# EAGLE design Adafruit Circuit Playground Bluefruit (EAGLE 9.3.2)
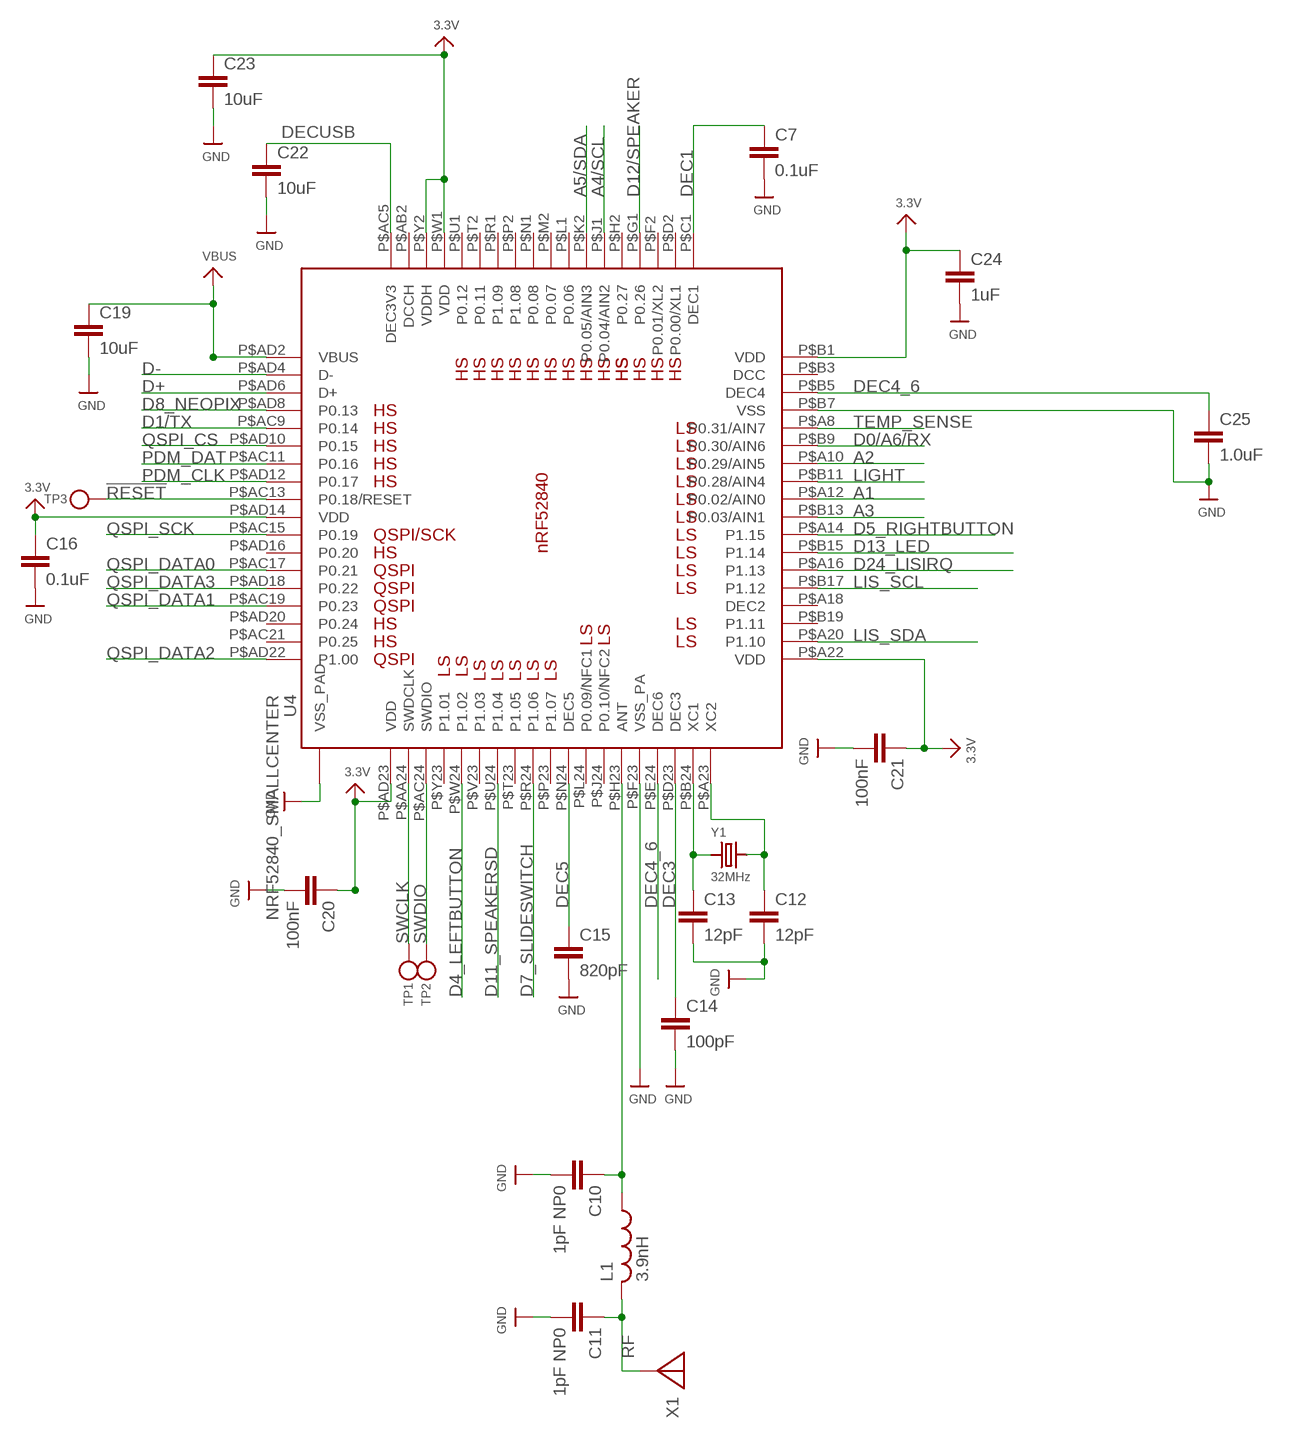
[diagram p0: schematic, sheet 1, part 1 of 2]
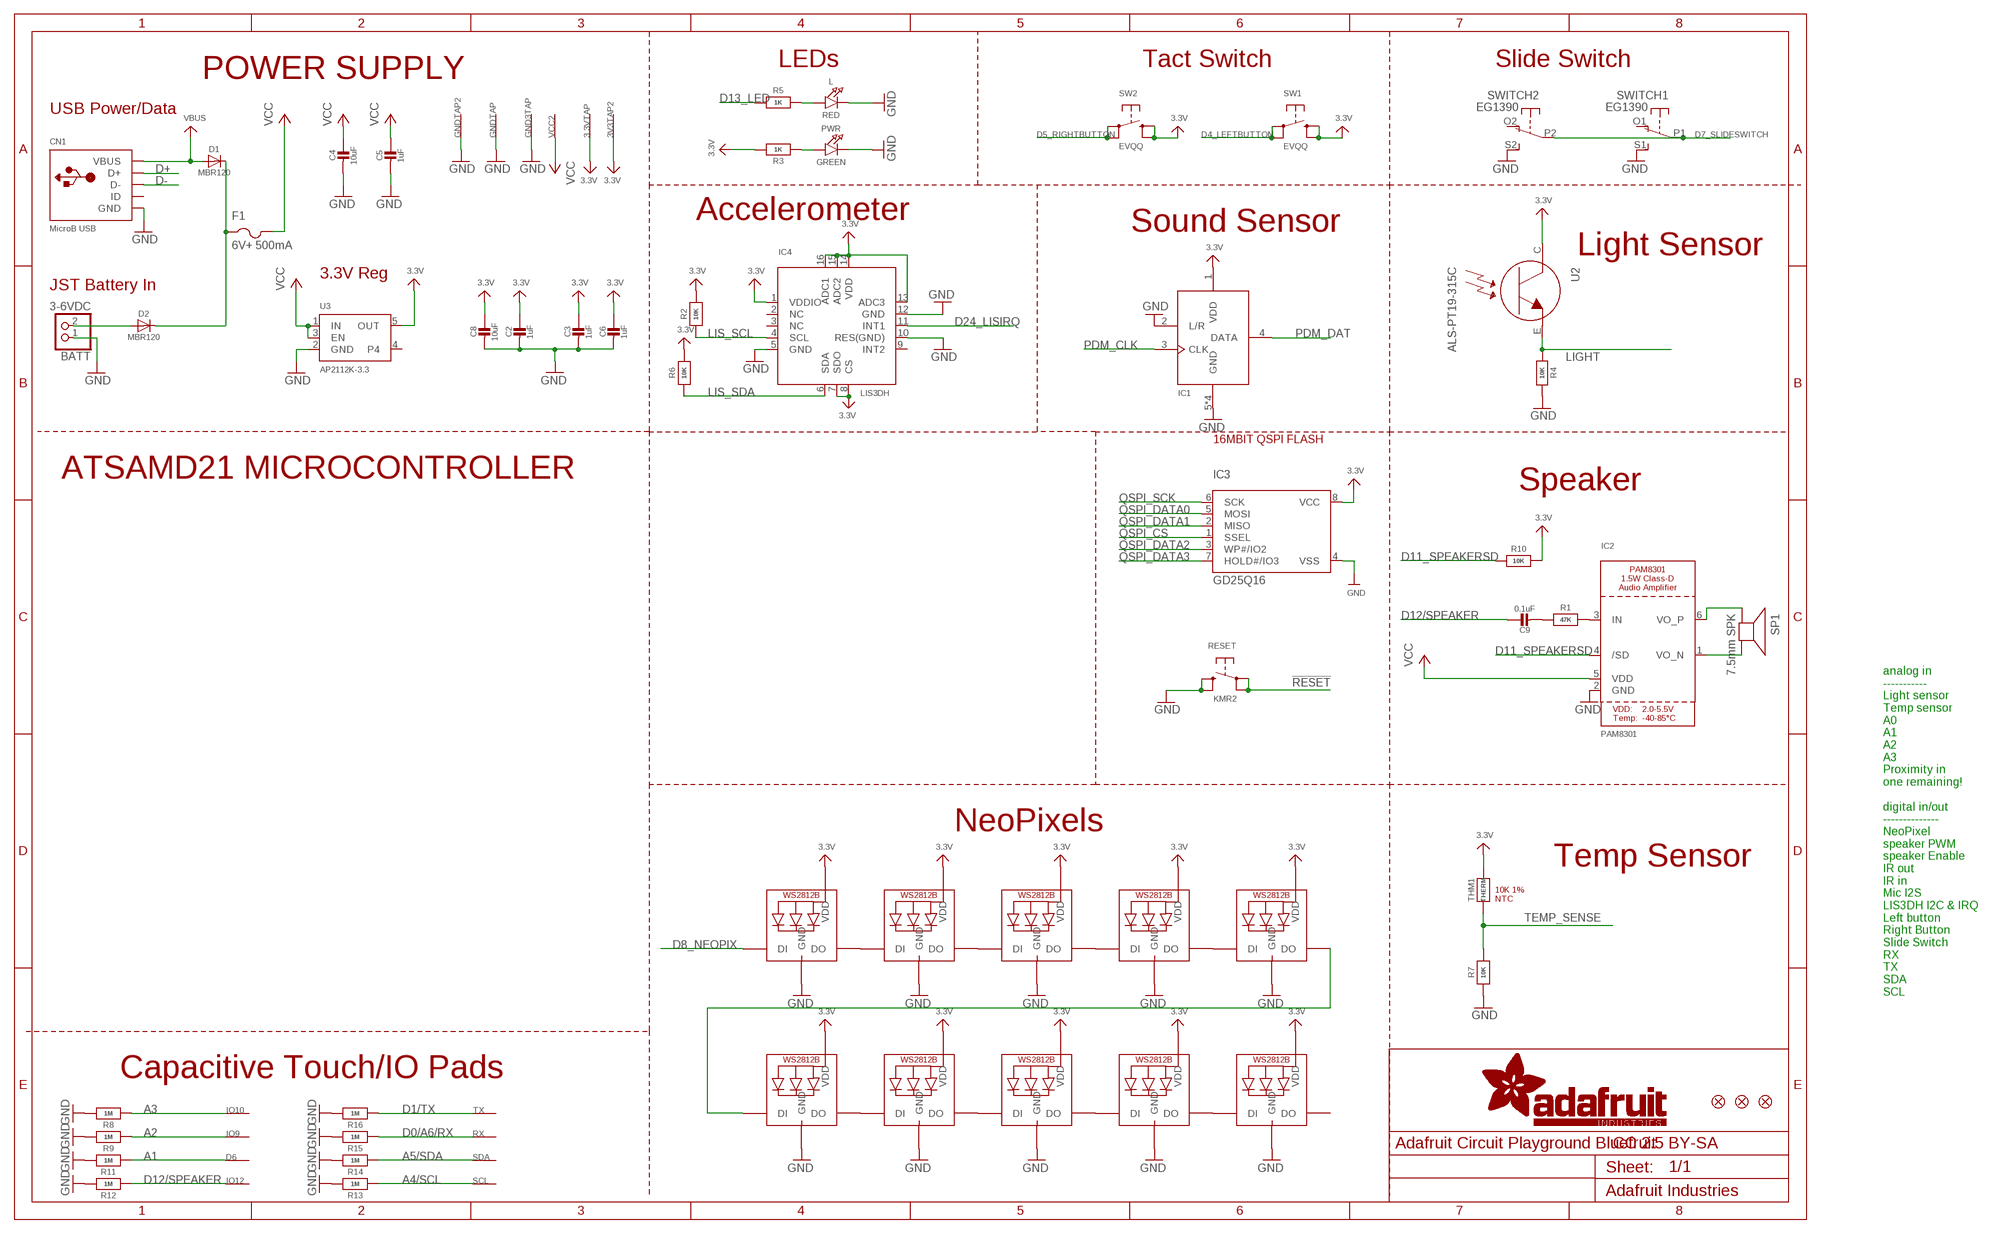
[diagram p1: schematic, sheet 1, part 2 of 2]

## Parts
3.3VTAP  SEWTAP-ALLIGATOR  [SEWALLI]
3V3TAP2  SEWTAP-ALLIGATOR  [SEWALLI]
BATT  3-6VDC  CON_JST_PH_2PIN  [JSTPH2]
C2  1uF  CAP_CERAMIC0603_NO  [0603-NO]
C3  1uF  CAP_CERAMIC0603_NO  [0603-NO]
C4  10uF  CAP_CERAMIC0805-NOOUTLINE  [0805-NO]
C5  1uF  CAP_CERAMIC0603_NO  [0603-NO]
C6  1uF  CAP_CERAMIC0603_NO  [0603-NO]
C7  0.1uF  CAPACITOR_0603_N  [RESC0603_N]
C8  10uF  CAP_CERAMIC0805-NOOUTLINE  [0805-NO]
C9  0.1uF  CAP_CERAMIC0603_NO  [0603-NO]
C10  1pF NP0  CAPACITOR_0402_N  [RESC0402_N]
C11  1pF NP0  CAPACITOR_0402_N  [RESC0402_N]
C12  12pF  CAPACITOR_0402_N  [RESC0402_N]
C13  12pF  CAPACITOR_0402_N  [RESC0402_N]
C14  100pF  CAPACITOR_0402_N  [RESC0402_N]
C15  820pF  CAPACITOR_0402_N  [RESC0402_N]
C16  0.1uF  CAPACITOR_0402_N  [RESC0402_N]
C19  10uF  CAPACITOR_0805_N  [RESC0805_N]
C20  100nF  CAPACITOR_0402_N  [RESC0402_N]
C21  100nF  CAPACITOR_0402_N  [RESC0402_N]
C22  10uF  CAPACITOR_0805_N  [RESC0805_N]
C23  10uF  CAPACITOR_0805_N  [RESC0805_N]
C24  1uF  CAPACITOR_0603_N  [RESC0603_N]
C25  1.0uF  CAPACITOR_0603_N  [RESC0603_N]
CN1  MicroB USB  USB_MICRO_20329_V2  [4UCONN_20329_V2]
D1  MBR120  DIODESOD-123  [SOD-123]
D2  MBR120  DIODESOD-123  [SOD-123]
D6  SEWTAP-ALLIGATOR  [SEWALLI]
F1  6V+ 500mA  PTCFUSE-1206  [R1206]
GND3TAP  SEWTAP-ALLIGATOR  [SEWALLI]
GNDTAP  SEWTAP-ALLIGATOR  [SEWALLI]
GNDTAP2  SEWTAP-ALLIGATOR  [SEWALLI]
IC1  MIC_PDM  MIC_PDM_SPK0415  [SPK0415HM4H]
IC2  PAM8301  [SOT23-6]
IC3  GD25Q16  SPIFLASH_8PINUX  [USON8]
IC4  LIS3DH  ACCEL_LIS3DHTR  [LGA16_3X3MM]
IO9  SEWTAP-ALLIGATOR  [SEWALLI]
IO10  SEWTAP-ALLIGATOR  [SEWALLI]
IO12  SEWTAP-ALLIGATOR  [SEWALLI]
L  RED  LED0805_NOOUTLINE  [CHIPLED_0805_NOOUTLINE]
L1  3.9nH  INDUCTOR_0402_N  [RESC0402_N]
LED1  WS2812B3535  [LED3535]
LED2  WS2812B3535  [LED3535]
LED3  WS2812B3535  [LED3535]
LED4  WS2812B3535  [LED3535]
LED5  WS2812B3535  [LED3535]
LED6  WS2812B3535  [LED3535]
LED7  WS2812B3535  [LED3535]
LED8  WS2812B3535  [LED3535]
LED9  WS2812B3535  [LED3535]
LED10  WS2812B3535  [LED3535]
PWR  GREEN  LED0805_NOOUTLINE  [CHIPLED_0805_NOOUTLINE]
R1  47K  RESISTOR_0603_NOOUT  [0603-NO]
R2  10K  RESISTOR_0603_NOOUT  [0603-NO]
R3  1K  RESISTOR_0603_NOOUT  [0603-NO]
R4  10K  RESISTOR_0603_NOOUT  [0603-NO]
R5  1K  RESISTOR_0603_NOOUT  [0603-NO]
R6  10K  RESISTOR_0603_NOOUT  [0603-NO]
R7  10K  RESISTOR_0603_NOOUT  [0603-NO]
R8  1M  RESISTOR_0603_NOOUT  [0603-NO]
R9  1M  RESISTOR_0603_NOOUT  [0603-NO]
R10  10K  RESISTOR_0603_NOOUT  [0603-NO]
R11  1M  RESISTOR_0603_NOOUT  [0603-NO]
R12  1M  RESISTOR_0603_NOOUT  [0603-NO]
R13  1M  RESISTOR_0603_NOOUT  [0603-NO]
R14  1M  RESISTOR_0603_NOOUT  [0603-NO]
R15  1M  RESISTOR_0603_NOOUT  [0603-NO]
R16  1M  RESISTOR_0603_NOOUT  [0603-NO]
RESET  KMR2  SWITCH_TACT_SMT4.6X2.8  [BTN_KMR2_4.6X2.8]
RX  SEWTAP-ALLIGATOR  [SEWALLI]
SCL  SEWTAP-ALLIGATOR  [SEWALLI]
SDA  SEWTAP-ALLIGATOR  [SEWALLI]
SP1  7.5mm SPK  SPEAKER_7.5MM  [BUZZER_SMT_7.5MM]
SW1  EVQQ  SWITCH_TACT_SMT_EVQQ2_SMALL  [EVQ-Q2_SMALLER]
SW2  EVQQ  SWITCH_TACT_SMT_EVQQ2_SMALL  [EVQ-Q2_SMALLER]
SWITCH  EG1390  DPDT-EG1390  [EG1390]
THM1  THERM  RESISTOR_0402  [_0402]
TP1  TESTPOINTROUND1.5MMNO  [TESTPOINT_ROUND_1.5MM_NO]
TP2  TESTPOINTROUND1.5MMNO  [TESTPOINT_ROUND_1.5MM_NO]
TP3  TESTPOINTROUND1.5MMNO  [TESTPOINT_ROUND_1.5MM_NO]
TX  SEWTAP-ALLIGATOR  [SEWALLI]
U2  ALS-PT19-315C  PHOTOTRANSISTOR_PT19-315C  [ALS-PT19-315C]
U3  AP2112K-3.3  VREG_SOT23-5  [SOT23-5]
U4  NRF52840_SMALLCENTER  [AQFN50P700X800X85_HS-74N_SMALLCENTER]
U$2  FIDUCIAL_1MM  [FIDUCIAL_1MM]
U$3  FIDUCIAL_1MM  [FIDUCIAL_1MM]
U$6  FIDUCIAL_1MM  [FIDUCIAL_1MM]
VCC2  SEWTAP-ALLIGATOR  [SEWALLI]
X1  ANTENNA_JOHANSON_2450AT18B100  [ANT_2450AT18B100]
Y1  32MHz  CRYSTAL2.5X2.0  [CRYSTAL_2.5X2]

## Nets
3.3V [power]: 3.3VTAP.P$1(SEW) 3V3TAP2.P$1(SEW) C2.1 C3.1 C6.1 C8.1 C16.1 C20.1 C21.1 C23.1 C24.1 IC1.1(VDD) IC3.8(VCC) IC4.1(VDDIO) IC4.7(SDO) IC4.8(CS) IC4.13(ADC3) IC4.14(VDD) IC4.15(ADC2) IC4.16(ADC1) LED1.2(VDD) LED2.2(VDD) LED3.2(VDD) LED4.2(VDD) LED5.2(VDD) LED6.2(VDD) LED7.2(VDD) LED8.2(VDD) LED9.2(VDD) LED10.2(VDD) R2.2 R3.2 R6.2 R10.2 SW1.B'(S1) SW1.B(S) SW2.B'(S1) SW2.B(S) THM1.2 U2.C U3.5(OUT) U4.P$A22(VDD) U4.P$AD14(VDD) U4.P$AD23(VDD) U4.P$B1(VDD) U4.P$W1(VDD) U4.P$Y2(VDDH)
!RESET: RESET.A'(P1) RESET.A(P) TP3.P$1 U4.P$AC13(P0.18/RESET)
A1: D6.P$1(SEW) R11.1 U4.P$A12(P0.02/AIN0)
A2: IO9.P$1(SEW) R9.1 U4.P$A10(P0.29/AIN5)
A3: IO10.P$1(SEW) R8.1 U4.P$B13(P0.03/AIN1)
A4/SCL: R13.1 SCL.P$1(SEW) U4.P$J1(P0.04/AIN2)
A5/SDA: R14.1 SDA.P$1(SEW) U4.P$K2(P0.05/AIN3)
D0/A6/RX: R15.1 RX.P$1(SEW) U4.P$B9(P0.30/AIN6)
D1/TX: R16.1 TX.P$1(SEW) U4.P$AC9(P0.14)
D4_LEFTBUTTON: SW1.A'(P1) SW1.A(P) U4.P$W24(P1.02)
D5_RIGHTBUTTON: SW2.A'(P1) SW2.A(P) U4.P$A14(P1.15)
D7_SLIDESWITCH: SWITCH.P1(1:P) SWITCH.P2(2:P) U4.P$R24(P1.06)
D8_NEOPIX: LED6.1(DI) U4.P$AD8(P0.13)
D11_SPEAKERSD: IC2.4(/SD) R10.1 U4.P$U24(P1.04)
D12/SPEAKER: C9.1 IO12.P$1(SEW) R12.1 U4.P$G1(P0.26)
D13_LED: R5.1 U4.P$B15(P1.14)
D24_LISIRQ: IC4.11(INT1) U4.P$A16(P1.13)
D+: CN1.D+ U4.P$AD6(D+)
D-: CN1.D- U4.P$AD4(D-)
DEC1: C7.1 U4.P$C1(DEC1)
DEC3: C14.1 U4.P$D23(DEC3)
DEC4_6: C25.1 U4.P$B5(DEC4) U4.P$E24(DEC6)
DEC5: C15.1 U4.P$N24(DEC5)
DECUSB: C22.1 U4.P$AC5(DEC3V3)
GND [power]: BATT.1 C2.2 C3.2 C4.2 C5.2 C6.2 C7.2 C8.2 C10.2 C11.2 C12.2 C13.2 C14.2 C15.2 C16.2 C19.2 C20.2 C21.2 C22.2 C23.2 C24.2 C25.2 CN1.BASE@1(GND) CN1.BASE@2(GND) CN1.GND CN1.SPRT@1(GND) CN1.SPRT@2(GND) CN1.SPRT@3(GND) CN1.SPRT@4(GND) GND3TAP.P$1(SEW) GNDTAP2.P$1(SEW) GNDTAP.P$1(SEW) IC1.2(L/R) IC1.5(GND) IC1.6(GND) IC1.7(GND) IC1.8(GND) IC2.2(GND) IC3.4(VSS) IC4.5(GND) IC4.10(RES(GND)) IC4.12(GND) L.C LED1.4(GND) LED2.4(GND) LED3.4(GND) LED4.4(GND) LED5.4(GND) LED6.4(GND) LED7.4(GND) LED8.4(GND) LED9.4(GND) LED10.4(GND) PWR.C R4.1 R7.1 R8.2 R9.2 R11.2 R12.2 R13.2 R14.2 R15.2 R16.2 RESET.B'(S1) RESET.B(S) SWITCH.S1(1:S) SWITCH.S2(2:S) U3.2(GND) U4.P$B7(VSS) U4.P$F23(VSS_PA) U4.THERMPAD(VSS_PAD)
LIGHT: R4.2 U2.E U4.P$B11(P0.28/AIN4)
LIS_SCL: IC4.4(SCL) R2.1 U4.P$B17(P1.12)
LIS_SDA: IC4.6(SDA) R6.1 U4.P$A20(P1.10)
N$1: PWR.A R3.1
N$3: D1.C D2.C F1.1
N$4: C10.1 L1.1 U4.P$H23(ANT)
N$6: C9.2 R1.1
N$7: BATT.2 D2.A
N$8: IC2.3(IN) R1.2
N$9: IC2.6(VO_P) SP1.+
N$10: L.A R5.2
N$11: LED1.1(DI) LED2.3(DO)
N$12: LED1.3(DO) LED3.1(DI)
N$13: LED2.1(DI) LED10.3(DO)
N$14: LED6.3(DO) LED7.1(DI)
N$15: IC2.1(VO_N) SP1.-
N$16: LED7.3(DO) LED8.1(DI)
N$17: LED8.3(DO) LED9.1(DI)
N$18: LED9.3(DO) LED10.1(DI)
N$19: LED3.3(DO) LED4.1(DI)
N$20: LED4.3(DO) LED5.1(DI)
N$22: C12.1 U4.P$A23(XC2) Y1.3
N$23: C13.1 U4.P$B24(XC1) Y1.1
PDM_CLK: IC1.3(CLK) U4.P$AD12(P0.17)
PDM_DAT: IC1.4(DATA) U4.P$AC11(P0.16)
QSPI_CS: IC3.1(SSEL) U4.P$AD10(P0.15)
QSPI_DATA0: IC3.5(MOSI) U4.P$AC17(P0.21)
QSPI_DATA1: IC3.2(MISO) U4.P$AC19(P0.23)
QSPI_DATA2: IC3.3(WP#/IO2) U4.P$AD22(P1.00)
QSPI_DATA3: IC3.7(HOLD#/IO3) U4.P$AD18(P0.22)
QSPI_SCK: IC3.6(SCK) U4.P$AC15(P0.19)
RF: C11.1 L1.2 X1.FP
SWCLK: TP1.P$1 U4.P$AA24(SWDCLK)
SWDIO: TP2.P$1 U4.P$AC24(SWDIO)
TEMP_SENSE: R7.2 THM1.1 U4.P$A8(P0.31/AIN7)
VBUS [power]: C19.1 CN1.VBUS D1.A U4.P$AD2(VBUS)
VCC: C4.1 C5.1 F1.2 IC2.5(VDD) U3.1(IN) U3.3(EN) VCC2.P$1(SEW)
Unconnected: CN1.ID IC4.2(NC) IC4.3(NC) IC4.9(INT2) LED5.3(DO) SWITCH.O1(1:O) SWITCH.O2(2:O) U3.4 U4.P$A18(DEC2) U4.P$AB2(DCCH) U4.P$AC21(P0.25) U4.P$AD16(P0.20) U4.P$AD20(P0.24) U4.P$B3(DCC) U4.P$B19(P1.11) U4.P$D2(P0.00/XL1) U4.P$F2(P0.01/XL2) U4.P$H2(P0.27) U4.P$J24(P0.10/NFC2) U4.P$L1(P0.06) U4.P$L24(P0.09/NFC1) U4.P$M2(P0.07) U4.P$N1(P0.08) U4.P$P2(P1.08) U4.P$P23(P1.07) U4.P$R1(P1.09) U4.P$T2(P0.11) U4.P$T23(P1.05) U4.P$U1(P0.12) U4.P$V23(P1.03) U4.P$Y23(P1.01)

## Notes on the sheet
- LEDs | Tact Switch | Slide Switch
- POWER SUPPLY
- USB Power/Data
- Accelerometer
- Sound Sensor
- Light Sensor
- 3.3V Reg
- JST Battery In
- 16MBIT QSPI FLASH
- ATSAMD21 MICROCONTROLLER
- Speaker
- NeoPixels
- Temp Sensor
- 10K 1%
  NTC
- analog in
  -----------
  Light sensor ✓
  Temp sensor ✓
  A0 ✓
  A1 ✓
  A2 ✓
  A3 ✓
  Proximity in ✓
  one remaining!
  
  digital in/out
  --------------
  NeoPixel ✓
  speaker PWM ✓
  speaker Enable ✓
  IR out ✓
  IR in ✓
  Mic I2S ✓
  LIS3DH I2C & IRQ
  Left button ✓
  Right Button ✓
  Slide Switch ✓
  RX ✓
  TX ✓
  SDA ✓
  SCL ✓
- Capacitive Touch/IO Pads
- CC 2.5 BY-SA

## Library data of the parts
3.3VTAP 3V3TAP2 D6 GND3TAP GNDTAP GNDTAP2 IO9 IO10 IO12 RX SCL SDA TX VCC2 = microbuilder:SEWTAP
BATT = microbuilder:CON_JST_PH_2PIN: JST 2-Pin Right-Angle Connector PH-Series - 4UConnector: 17311 SH-Series - 4UConnector: 07278
C2-C6 C8 C9 = microbuilder:CAP_CERAMIC: Ceramic Capacitors For new designs, use the packages preceded by an '_' character since they are more reliable: The following footprints should be used on most boards: _0402 - Standard footprint for regular board layouts _0603 - Standard footprint for regular board layouts _0805 - Standard footprint for regular board layouts _1206 - Standard footprint for regular board layouts For extremely tight-pitch boards where space is at a premium, the following 'micro-pitch' footprints can be used (smaller pads, no silkscreen outline, etc.): _0402MP - Micro-pitch footprint for very dense/compact boards _0603MP - Micro-pitch footprint for very dense/compact boards _0805MP - Micro-pitch footprint for very dense/compact boards _1206MP - Micro-pitch footprint for very dense/compact boards
C7 C10-C16 C19-C25 = Nordic_misc:CAPACITOR: Generic chip capacitor
CN1 = microbuilder:USB: USB Connectors USBMINIB - Surface Mount Female Mini-B USB Connector 4UConnector: 06564
D1 D2 = microbuilder:DIODE: Diode SMA Model Volts Amps Type Vf Ir Digikey # Notes SSA34-E3 40V 3A Schottky 480mV @ 3A 200uA @ 40V SSA34-E3/61TGITR-ND CDBA120-G 20V 1A Schottky 500mV @ 1A 500uA @ 20V 641-1014-6-ND REEL MBRA210 10V 2A Schottky 350mV @ 2A 700uA @ 10V MBRA210LT3 SOD-123 Model Volts Amps Type Vf Ir Order # Notes BAT54T1G 30V 200mA Schottky 800mV @ 200mA 2uA @ 25V BAT54T1GOSTR-ND B0530W 30V 500mA Schottky 430mV @ 500mA 130uA @ 30V B0530W-FDICT-ND REEL MBR120 20V 1A Schottky 340mV @ 1A MBR120VLSFT1GOSCT-ND SOD-323 Model Volts Amps Type Vf Ir Order # Notes PMEG2005EJ 20V 500mA Schottky 355mV @ 500mA 568-4110-1-ND ZLLS410 10V 570mA Schottky 380mV @ 570mA ZLLS410CT-ND 1N4148WS 75V 150mA Silicon/Simple 1V 1N4148WSFSCT-ND REEL SOD-523 Model Volts Amps Type Vf Ir Order # Notes BAT54XV2 30V 200mA Schottky 0.8V @ 100mA BAT54XV2CT-ND TB751S 30V 30mA Schottky RB751S-40TE61CT-ND SOT23-R/W (R = Solder Paste/Reflow Ovens, W = Hand-Soldering) Model Volts Amps Type Vf Ir Order # Notes BAT54FILM 40V 300mA Schottky 497-7162-1-ND POWERDI-5 Model Volts Amps Type Vf Ir Order # Notes PDS560 60V 5A Schottky 670mV @ 5A 150uA @ 60V PDS560DICT-ND
F1 = adafruit:PTCFUSE: PTC fuses, resettable thermistors
IC1 = microbuilder:MIC_PDM
IC2 = microbuilder:PAM8301
IC3 = microbuilder:SPIFLASH_8PIN: SOIC8 SPI Flash Be careful with the size since SOIC8 flash comes in several 'widths' SOIC8 150 mil M25P16 - 16Mbit (2Mbit x 8) Serial Flash (75MHz SPI Bus), Supply: 2.7-3.6V Digikey: SOIC8 - M25P16-VMN6P-ND SOIC8 208 mil W25Q16BVSSIG - 16Mbit (2Mbit x 8) Serial Flash (104MHz SPI Bus), Supply: 2.7-3.6V Digikey: SOIC8 - W25Q16BVSSIG-ND
IC4 = microbuilder:ACCEL_LIS3DHTR: LIS3DHTR 3-Axis Accelerometer with I2C/SPI Interface VDD: 1.71-3.6V VDDIO: 1.71-VDD+0.1V Scale: +/-2g, 4g, 8g, 16g with 16--bit data output Temp:: -40°C - 85°C Mouser: 511-LIS3DHTR Digikey: 497-10613-1-ND
L PWR = microbuilder:LED: LED 0603 - 0603 Surface Mount Package 2mA: Green LED - Low Power (3.9mcd, 2ma, 1.7Vf) - Digikey: 475-2709-2-ND Orange LED - Low Power (9.8mcd, 2ma, 1.8Vf) - Digikey: 475-1194-2-ND Red LED - Low Power (5mcd, 2ma, 1.8Vf) - Digikey: 475-1195-2-ND Yellow LED - Low Power (7mcd, 2ma, 1.8Vf) - Digikey: 475-1196-2-ND 5mA: Blue LED - Low Power (17mcd, 5ma, 2.9Vf) - Digikey: LNJ937W8CRACT-ND 0805 - 0805 Surface Mount Package 2mA: Red LED (8.8mcd, 2mA, 1.8Vf, Clear) - Low Power [Digikey: 475-2510-1-ND] Green LED (5mcd, 2mA, 1.8Vf, Clear) - Low Power [Digikey: 475-2730-1-ND] Yellow LED (11.3mcd, 2mA, 1.8Vf, Clear) - Low Power [Digikey: 475-2555-1-ND] 20mA: Red LED (104mcd, 20mA, Diffused) - LS R976 [Digikey: 475-1278-6-ND] Red LED (12mcd, 20mA, 2.0Vf, Clear) - APT2012EC [Digikey: 754-1128-1-ND] Green LED (15mcd, 20mA, 2.2Vf, Clear) - APT2012GC [Digikey: 754-1131-1-ND] Orange LED (160mcd, 20mA, 2.1Vf, Clear) - APT2012SECK [Digikey: 754-1130-1-ND] 1206 - 1206 Surface Mount Package Green LED (26mcd, 20mA, Diffused) - LG N971 [Digikey: 475-1407-6-ND] Red LED (15mcd, 20mA, Diffused) - LH N974 [Digikey: 475-1416-6-ND] Cree - Cree High-Power Surface Mount LEDs XPEBWT-L1-0000-00D50 - White 111lm 350mA 2.9Vf 6200K 110° XTEAWT-00-0000-00000LEE3 - White 114lm 350mA 2.85Vf 5000K 115° Everlight - Everlight 45-21 Series Surface Mount LEDs 45-21/QK2C-B2832AC2CB2/2T - Warm White 2000mcd 20mA 3.25Vf 3050K 120° 45-21/LK2C-B38452C4CB2/2T - Nuetral White 2000mcd 20mA 3.25Vf 4150K 120° 45-21/LK2C-B50634C6CB2/2T - Cold White 2200mcd 20mA 3.25Vf 5650K 120° PLCC2 Reverse Mount LS T77K-J1L2-1-0-2-R18-Z - Red 11.25mcd 2mA 1.8Vf 630nm 120° LO T77K-L1M2-24-Z - Orange 19.6mcd 2mA 1.8Vf 606nm 120° LY T77K-K2M1-26-Z - Yellow 15.7mcd 2mA 1.8Vf 587nm 120°
L1 = Nordic_misc:INDUCTOR: Generic chip inductor
LED1-LED10 = microbuilder:WS2812B
R1-R16 THM1 = microbuilder:RESISTOR: Resistors For new designs, use the packages preceded by an '_' character since they are more reliable: The following footprints should be used on most boards: _0402 - Standard footprint for regular board layouts _0603 - Standard footprint for regular board layouts _0805 - Standard footprint for regular board layouts _1206 - Standard footprint for regular board layouts For extremely tight-pitch boards where space is at a premium, the following 'micro-pitch' footprints can be used (smaller pads, no silkscreen outline, etc.): _0402MP - Micro-pitch footprint for very dense/compact boards _0603MP - Micro-pitch footprint for very dense/compact boards _0805MP - Micro-pitch footprint for very dense/compact boards _1206MP - Micro-pitch footprint for very dense/compact boards
RESET SW1 SW2 = microbuilder:SWITCH_TACT_SMT: SMT Tact Switches 6x6mm - Digikey: P12940SCT-ND KMR2 (4.6x2.8mm) - Digikey: 401-1426-1-ND EVQ-PQHB55 - Light Touch, 160GF (4.5x4.5mm) - Digikey: P8090SCT-ND KMT0 - KMT021 NGJ LHS (etc.) IP68/Waterproof - Digikey: CKN10289CT-ND
SP1 = microbuilder:SPEAKER: SPEAKER Source: Buerklin Added PS12 (for part # PS1240 piezo) http://www.ladyada.net/library/pcb/eaglelibrary.html
SWITCH = adafruit:DPDT
TP1-TP3 = microbuilder:TESTPOINT: Test Point Various test points for characterisation and PCB testing TESTPOINT_SMT - Compact Surface Mount Test Point [Digikey: 5016KTR-ND]
U2 = microbuilder:PHOTOTRANSISTOR: ALS-PT19-315C - Analog Light Sensor VCC: 2.5-5.5V
U3 = microbuilder:VREG_SOT23-5: SOT23-5 Fixed Voltage Regulators Part Current Out V Out V In V Dropout θJA (°C/W) TJ (°C) Digikey Part No. ADP121 150mA 3.3V 3.4-5.5V 0.09V @ 150mA -- -- ADP121-AUJZ33R7CT-ND ADP121 150mA 3.0V 3.1-5.5V 0.09V @ 150mA -- -- ADP121-AUJZ30R7CT-ND ADP122 300mA 3.3V 3.4-5.5V 0.085V @ 300mA -- -- ADP122AUJZ-3.3-R7CT-ND ADP1712 300mA 3.3V 3.5-5.5V 0.17V @ 300mA -- -- ADP1712AUJZ-3.3-R7TR-ND AP7311 (Low Cost) 150mA 3.3V 3.5-6V 0.15V @ 150mA -- -- AP7311-33WG-7DICT-ND LD39015M18R 150mA 1.8V 1.9V-5.5V 0.08V @ 100mA -- -- 497-6977-1-ND LP2985A-33DBVR 150mA 3.3V 3.3-16V 0.28V @ 150mA 206 150 296-18479-1-ND MCP1824T-3302E/OT 300mA 3.3V 3.5V-6V 0.2V @ 300mA -- -- MCP1824T-3302E/OTCT-ND MIC5205-2.5YM5 TR 150mA 2.5V 2.7-16V 0.165V @ 150mA -- -- 576-1257-2-ND MIC5205-3.0YM5 TR 150mA 3.0V 3.2V-16V 0.165V @ 150mA -- -- 576-1258-2-ND MIC5205-3.3YM5 TR 150mA 3.3V 3.5V-16V 0.165V @ 150mA -- -- 576-1259-2-ND TPS780330220 150mA 3.3V+2.2V 3.6-5.5V 250mV Max -- -- 296-23332-1-ND TDA3663/N1,135 100mA 3.3V 3.5-45V 0.18V @ 50mA -- -- 568-5343-1-ND Max operating temp can be calculated using θJA, TJ (max junction temperature), and power in watts. Set the "Maximum Ambient Temperature" until it reaches TJ ("Max Junction Temperature"), which is the absolute limit for safe use of the regulator: Heat Sink Temperature Calculator <http://www.daycounter.com/Calculators/Heat-Sink-Temperature-Calculator.phtml> For example, With 12V source into a 3.3V LP2985 and a 30mA load, we are dissipating (12V-3.3V) * 0.03A = 0.261W. With a θJA of 206 °C/W, a TJ of 150°C, and 261mW we can safely use the chip without a heat sink up to 75°C (=147.1°C Junction Temperature).
U4 = microbuilder:NRF52840: nRF52840 Features Advanced Single chip 2.4 GHz multi-protocol SoC 32-bit ARM Cortex-M4F Processor 1.7v to 5.5v operation 1MB flash + 256kB RAM Bluetooth 5 support for long range and high throughput 802.15.4 radio support On-chip NFC PPI –Programmable Peripheral Interconnect Automated power management system with automatic power management of each peripheral Configurable I/O mapping for analog and digital I/O 48 x GPIO 1 x QSPI 4 x Master/Slave SPI 2 x Two-wire interface (I²C) I²S interface 2 x UART 4 x PWM USB 2.0 controller ARM TrustZone CryptoCell-310 Cryptographic and security module AES 128-bit ECB/CCM/AAR hardware accelerator Digital microphone interface (PDM) Quadrature decoder 12-bit ADC Low power comparator On-chip 50Ω balun On-air compatible with nRF52, nRF51 and nRF24 Series Applications Advanced high performance wearables Wearables for secure payments Virtual Reality/Augmented Reality systems Smart Home sensor networks Smart city sensor networks High performance HID controllers Internet of Things (IoT) sensor networks Smart door locks Smart lighting networks Connected white goods
U$2 U$3 U$6 = microbuilder:FIDUCIAL: Fiducial Alignment Points Various fiducial points for machine vision alignment.; BOM: EXCLUDE
X1 = microbuilder:ANTENNA_JOHANSON_2450AT18B100: Johanson 2.4GHz Chip Antenna (1206 Package) Frequency Range: 2400 - 2500 Mhz Peak Gain 0.5 dBi typ. (XZ-V) Average Gain -0.5 dBi typ. (XZ-V) Input Power 3W max. Operating Temperature -40 to +85°C Digikey: 712-1006-1-ND
Y1 = microbuilder:CRYSTAL: Crystals HC49UP - Surface Mount Crystal 4.0MHz 18pF +/-30ppm Surface Mount Crystal [Digikey: 535-9857-1-ND] 12.0 MHz Surface Mount Crystal [Digikey: 535-9869-6-ND] 25.0 MHz Surface Mount Crystal [Digikey: 535-9078-1-ND] 2.5 x 2.0mm - MEMs SMT Crystal 16.0 MHz 10pF 20ppm 2.5 x 2.0mm Crystal [Digikey -40-85°C: 535-10923-1-ND] 3.2 x 2.5mm - MEMs SMT Crystal 12.0 MHz 8pF 15ppm 3.2 x 2.5mm Crystal [Digikey: -10-70°C: 644-1047-1-ND -40-125°C: 644-1128-1-ND] 40~85°C cheaper: 644-1173-6-ND 16.0 MHz 8pF 15ppm 3.2 x 2.5mm Crystal [Digikey: -10-70°C: 644-1049-1-ND -40-125°C: 644-1129-2-ND]-40~85°C cheaper: 644-1175-6-ND 16.0 MHz 10pF 10ppm 3.2 x 2.5mm Crystal [Digikey: 644-1100-1-ND] 27.12 MHz 18pF 30ppm 3.2 x 2.5mm Crystal [Digikey: 887-1424-1-ND] 27.12MHz 10pF 10ppm 3.2 x 2.5mm Crystal [Digikey: 887-1329-1-ND] 4.9 x 1.8mm - MEMs SMT Crystal 32.768 KHz 12.5pF 20ppm 4.9 x 1.8mm Crystal [Digikey: SE2415CT-ND] 8.0 x 3.8mm - Surface Mount Crystal 32.768kHz 12.5pF 20ppm -40°C-85°C [Digikey: 535-9166-2-ND] Cylinder 32.768KHz Cylinder Crystal (2x6mm body) [Ex. Digikey: 300-8341-2-ND]

## Net classes
0 default: width 0.178 mm
1 power: width 0.254 mm

## Board
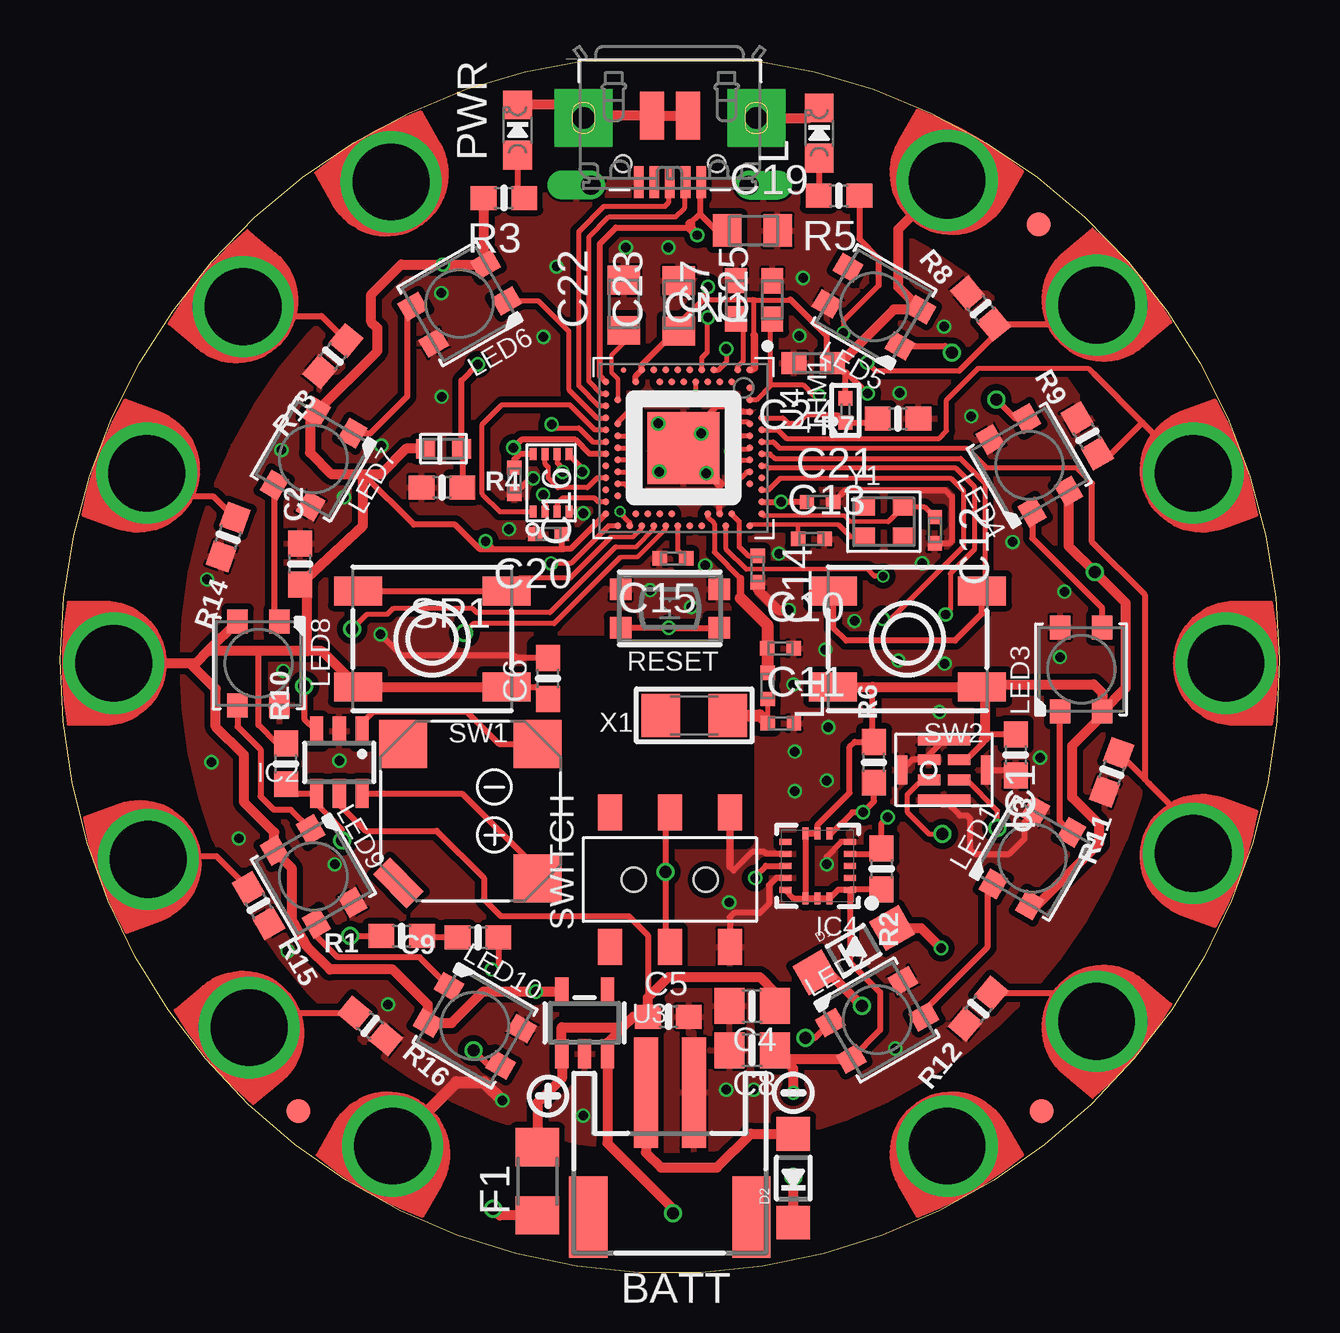
[diagram p2: board, top side]
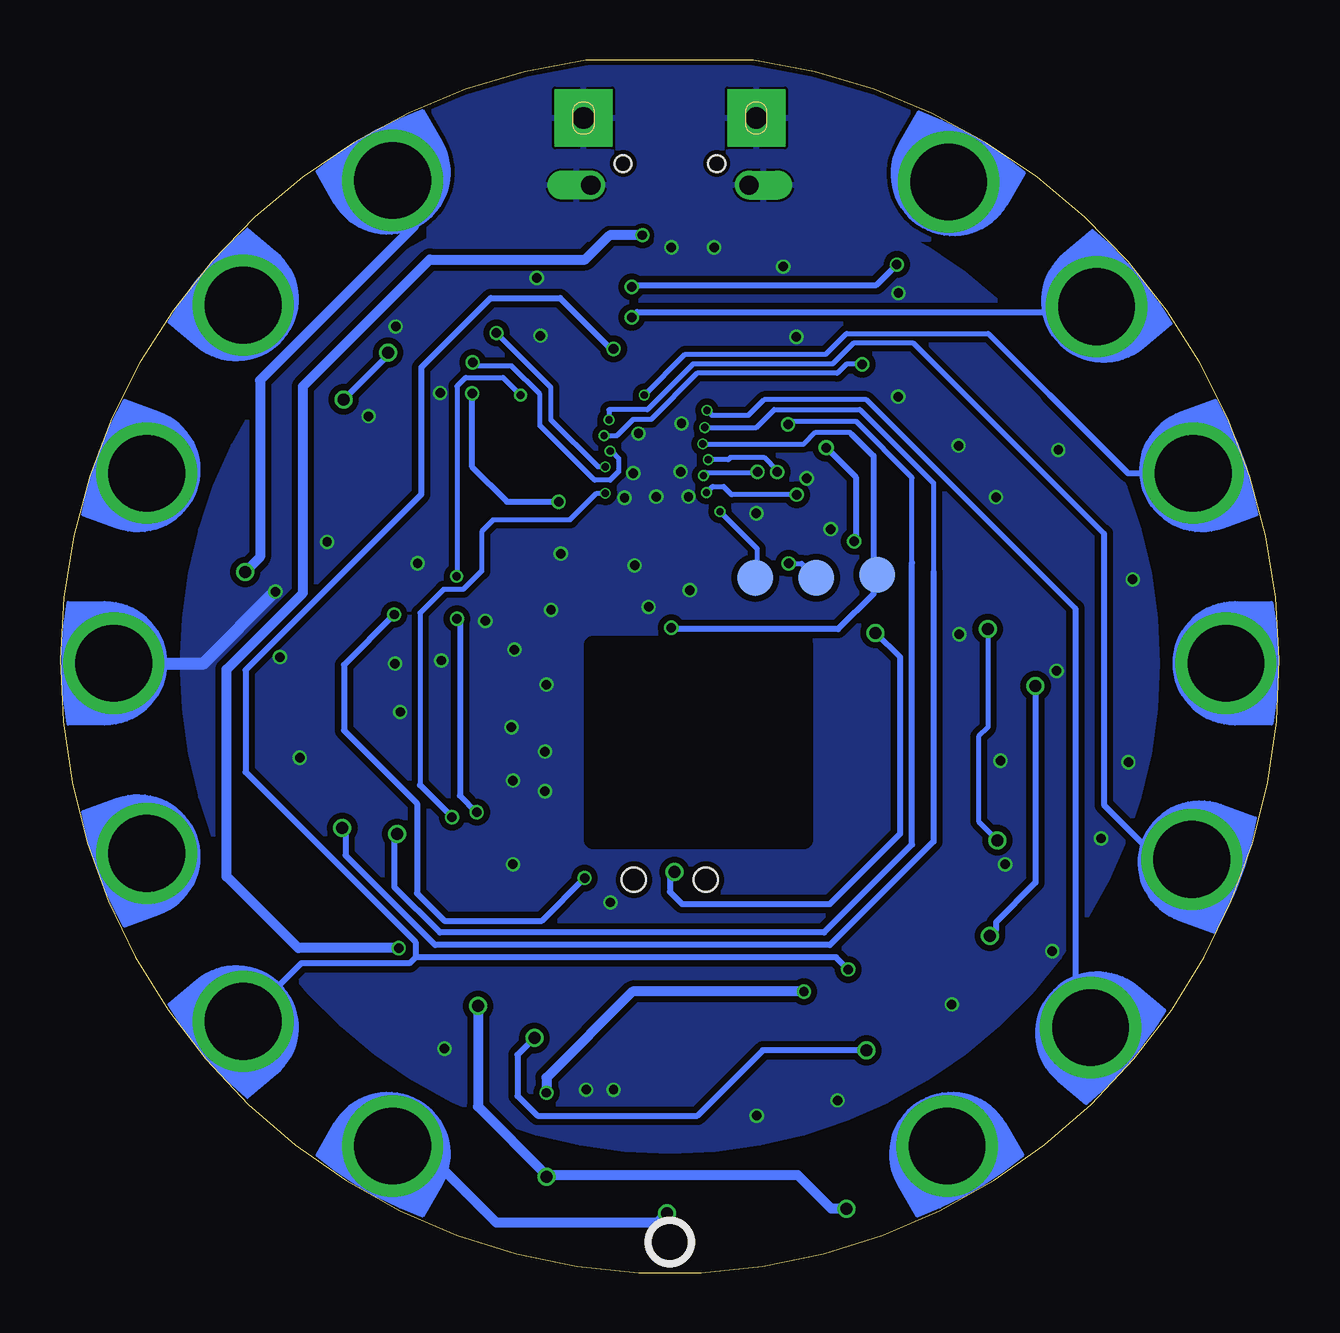
[diagram p3: board, bottom side, seen from below]

Size 50.82 x 50.55 mm. Coordinates in mm from the lower left corner, seen from the top.
Outline: 21.92,50.55 28.9,50.55 arc-344 21.92,50.55
Copper layers (1+2*15+16): Top 0.035mm / dielectric 0.2mm / Route2 0.035mm / dielectric 0.7mm / Route15 0.035mm / dielectric 0.2mm / Bottom 0.035mm
Design rules "xenon *": minimum track width 7mil, minimum drill 10mil, track to track 7mil, track to pad 7mil, pad to pad 7mil, via to via 7mil, smd to smd 6mil, copper to edge 8mil, drill to drill 12mil, minimum pad ring 3mil, minimum via ring 3mil, stop-mask expansion 0.05mm, vias tented up to drill 16mil, thermal gap 4mil
tRestrict: area 19.8,18 to 28.5,26.2
bRestrict: area 19.8,18 to 28.6,26.2

### Footprints (pad centres in the part's own frame; a part is rotated, then mirrored left to right if it is on the bottom)
SEWALLI = drill 3.2: P$1 0,0.508
JSTPH2 = smd 1 x 4.6: 1 -1,-3.7; 2 1,-3.7 | smd 1.6 x 3.4: NC1 -3.4,1.5; NC2 3.4,1.5
0603-NO = smd 1.075 x 1: 1 -0.85,0; 2 0.85,0
0805-NO = smd 1.24 x 1.5: 1 -0.95,0; 2 0.95,0
RESC0603_N = smd 1.05 x 0.9: 1 -0.8,0; 2 0.8,0
RESC0402_N = smd 0.6 x 0.6: 1 -0.55,0; 2 0.55,0
RESC0805_N = smd 1.2 x 1.35: 1 -1.1,0; 2 1,0
4UCONN_20329_V2 = smd 1 x 2: BASE@1 -0.75,-2; BASE@2 0.75,-2 | smd 0.4 x 1.35: D+ 0,0.775; D- -0.65,0.775; GND 1.3,0.775; ID 0.65,0.775; VBUS -1.3,0.775 | drill 0.8 pad 1.143 offset: SPRT@1 -3.3,0.9; SPRT@2 3.3,0.9 | drill 0.9 pad 2.413 square: SPRT@3 -3.6,-1.9; SPRT@4 3.6,-1.9 | hole 0.7: -1.95,0; 1.95,0
SOD-123 = smd 1.4 x 1.4: A 1.85,0; C -1.85,0
R1206 = smd 1.6 x 1.803: 1 -1.422,0; 2 1.422,0
SPK0415HM4H = smd 0.45 x 0.95: 1 0.425,-0.625; 2 0.425,0.625; 3 -0.425,0.625; 4 -0.425,-0.625 | smd 1.2 x 0.45: 5 0,-1.75; 7 0,1.75 | smd 0.45 x 2.2: 6 1.25,0; 8 -1.25,0
SOT23-6 = smd 0.55 x 1.2: 1 -0.95,-1.3; 2 0,-1.3; 3 0.95,-1.3; 4 0.95,1.3; 5 0,1.3; 6 -0.95,1.3
USON8 = smd 0.5 x 0.275: 1 -1.2,0.75; 2 -1.2,0.25; 3 -1.2,-0.25; 4 -1.2,-0.75; 5 1.2,-0.75; 6 1.2,-0.25; 7 1.2,0.25; 8 1.2,0.75
LGA16_3X3MM = smd 0.5 x 0.25: 1 -1.35,1; 2 -1.35,0.5; 3 -1.35,0; 4 -1.35,-0.5; 5 -1.35,-1; 9 1.35,-1; 10 1.35,-0.5; 11 1.35,0; 12 1.35,0.5; 13 1.35,1 | smd 0.25 x 0.5: 6 -0.5,-1.35; 7 0,-1.35; 8 0.5,-1.35; 14 0.5,1.35; 15 0,1.35; 16 -0.5,1.35
CHIPLED_0805_NOOUTLINE = smd 1.2 x 1.2: A 0,-1.05; C 0,1.05
LED3535 = smd 1 x 0.85: 1 -1.75,0.875; 2 -1.75,-0.875; 3 1.75,-0.875; 4 1.75,0.875
BTN_KMR2_4.6X2.8 = smd 0.9 x 0.9: A 2.05,0.8; A' -2.05,0.8; B 2.05,-0.8; B' -2.05,-0.8
BUZZER_SMT_7.5MM = smd 2 x 2: + 2.8,-2.8; - 2.8,2.8; MT2 -2.8,2.8 | smd 2 x 1 rotated 135: MT -3,-3
EVQ-Q2_SMALLER = smd 2 x 1.2: A -3.1,-2; A' 3.1,-2; B -3.1,2; B' 3.1,2
EG1390 = smd 1 x 1.5: O1 -2.5,2.8; O2 -2.5,-2.8; P1 0,2.8; P2 0,-2.8; S1 2.5,2.8; S2 2.5,-2.8 | hole 1: 1.5,0; -1.5,0
_0402 = smd 0.6 x 0.6: 1 -0.508,0; 2 0.508,0
TESTPOINT_ROUND_1.5MM_NO = smd 1.5 x 1.5: P$1 0,0
ALS-PT19-315C = smd 0.8 x 0.8: C -0.75,0; E 0.75,0
SOT23-5 = smd 0.55 x 1.2: 1 -0.95,-1.3; 2 0,-1.3; 3 0.95,-1.3; 4 0.95,1.3; 5 -0.95,1.3
AQFN50P700X800X85_HS-74N_SMALLCENTER = smd 0.3 x 0.3: P$A8 -1.25,3.25; P$A10 -0.75,3.25; P$A12 -0.25,3.25; P$A14 0.25,3.25; P$A16 0.75,3.25; P$A18 1.25,3.25; P$A20 1.75,3.25; P$A22 2.25,3.25; P$A23 2.75,3.25; P$AA24 3.25,-2.25; P$AC5 -2,-2.75; P$AC9 -1,-2.75; P$AC11 -0.5,-2.75; P$AC13 0,-2.75; P$AC15 0.5,-2.75; P$AC17 1,-2.75; P$AC19 1.5,-2.75; P$AC21 2,-2.75; P$AC24 3.25,-2.75; P$AD2 -2.75,-3.25; P$AD4 -2.25,-3.25; P$AD6 -1.75,-3.25; P$AD8 -1.25,-3.25; P$AD10 -0.75,-3.25; P$AD12 -0.25,-3.25; P$AD14 0.25,-3.25; P$AD16 0.75,-3.25; P$AD18 1.25,-3.25; P$AD20 1.75,-3.25; P$AD22 2.25,-3.25; P$AD23 2.75,-3.25; P$B1 -3.25,2.75; P$B3 -2.5,2.75; P$B5 -2,2.75; P$B7 -1.5,2.75; P$B9 -1,2.75; P$B11 -0.5,2.75; P$B13 0,2.75; P$B15 0.5,2.75; P$B17 1,2.75; P$B19 1.5,2.75; P$B24 3.25,2.75; P$C1 -3.25,2.25; P$D2 -2.75,2; P$D23 2.75,2; P$E24 3.25,1.75; P$F2 -2.75,1.5; P$F23 2.75,1.5; P$G1 -3.25,1.25; P$H2 -2.75,1; P$H23 2.75,1; P$J1 -3.25,0.75; P$J24 3.25,0.75; P$K2 -2.75,0.5; P$L1 -3.25,0.25; P$L24 3.25,0.25; P$M2 -2.75,0; P$N1 -3.25,-0.25; P$N24 3.25,-0.25; P$P2 -2.75,-0.5; P$P23 2.75,-0.5; P$R1 -3.25,-0.75; P$R24 3.25,-0.75; P$T2 -2.75,-1; P$T23 2.75,-1; P$U1 -3.25,-1.25; P$U24 3.25,-1.25; P$V23 2.75,-1.5; P$W1 -3.25,-1.75; P$W24 3.25,-1.75; P$Y2 -2.75,-2; P$Y23 2.75,-2 | smd 0.225 x 0.225: P$AB2 -3.25,-2.5 | smd 3 x 3: THERMPAD 0,0
FIDUCIAL_1MM = smd 1 x 1: 1 0,0
ANT_2450AT18B100 = smd 1.6 x 1.8: FP -1.4,0; NC 1.4,0
CRYSTAL_2.5X2 = smd 0.9 x 0.75: 1 -0.825,-0.625; 2 0.825,-0.625; 3 0.825,0.625; 4 -0.825,0.625

### Placement (x,y rotation side)
3.3VTAP  2.74,25.4 90 top
3V3TAP2  36.71,45.09 330 top
BATT  25.41,3.81 180 top
C2  9.99,29.53 90 top
C3  39.82,21.58 270 top
C4  28.84,11.11 180 top
C5  25.35,10.67 0 top
C6  20.33,24.77 90 top
C7  28.17,40.55 90 top
C8  28.84,9.27 180 top
C9  17.41,13.97 180 top
C10  30.02,26.02 0 top
C11  30.03,22.9 0 top
C12  36.45,30.95 270 top
C13  31.3,30.58 0 top
C14  29.07,29.32 270 top
C15  25.54,29.77 180 top
C16  18.93,33.01 270 top
C19  28.9,43.43 0 top
C20  20.35,30.79 180 top
C21  31.67,32.12 0 top
C22  23.49,40.37 90 top
C23  25.78,40.35 90 top
C24  31.38,37.91 180 top
C25  29.68,40.54 90 top
CN1  25.41,46.23 180 top
D1  33.07,13.44 30 top
D2  30.55,3.94 90 top
D6  46.75,17.65 250 top
F1  19.89,3.81 90 top
GND3TAP  14.04,45.02 30 top
GNDTAP  48.08,25.4 270 top
GNDTAP2  14.11,5.72 150 top
IC1  36.84,20.96 90 top
IC2  11.63,21.27 180 top
IC3  20.46,32.92 90 top
IC4  31.57,16.95 180 top
IO9  46.75,33.15 290 top
IO10  42.81,40.01 310 top
IO12  42.81,10.8 230 top
L  31.63,47.5 0 top
L1  29.49,24.46 270 top
LED1  40.52,17.27 60 top
LED2  34.05,10.54 30 top
LED3  42.55,25.15 90 top
LED4  40.4,33.66 120 top
LED5  33.92,40.26 150 top
LED6  16.65,40.39 210 top
LED7  10.55,33.91 240 top
LED8  8.26,25.4 270 top
LED9  10.55,16.51 300 top
LED10  17.28,10.29 330 top
PWR  19.06,47.63 0 top
R1  14.23,14.03 180 top
R2  34.24,16.83 270 top
R3  18.49,44.79 180 top
R4  15.91,32.73 0 top
R5  32.46,44.89 180 top
R6  33.92,21.27 90 top
R7  34.92,35.6 180 top
R8  38.36,40.18 130 top
R9  42.81,34.87 120 top
R10  9.41,21.21 90 top
R11  43.82,20.85 250 top
R12  38.27,11 230 top
R13  11.36,38.2 230 top
R14  6.99,30.66 250 top
R15  8.26,15.29 300 top
R16  12.91,10.28 320 top
RESET  25.41,27.69 180 top
RX  4.14,17.4 110 top
SCL  8.01,39.94 50 top
SDA  4.07,33.15 70 top
SP1  17.09,19.24 0 top
SW1  15.5,26.42 180 top
SW2  35.32,26.42 180 top
SWITCH  25.41,16.38 0 top
THM1  32.72,35.94 90 top
TP1  21.85,28.96 270 bottom
TP2  19.31,28.96 270 bottom
TP3  16.77,29.08 270 bottom
TX  8.26,10.54 130 top
U2  15.97,34.34 0 top
U3  21.85,10.41 0 top
U4  25.98,34.38 270 top
U$1  [SYMBOL_MINUS]  30.55,7.49 0 top
U$2  40.78,43.69 0 top
U$3  9.92,6.73 0 top
U$6  40.9,6.73 0 top
U$7  [PCBFEAT-REV-040]  25.41,1.27 0 bottom
U$16  [CPLAY_BLUEFRUIT_BOT]  50.81,0 0 bottom
U$35  [SYMBOL_PLUS]  20.33,7.37 0 top
U$44  [CPLAY_BLUEFRUIT_TOP]  0.01,0 0 top
VCC2  36.71,5.72 210 top
X1  26.43,23.23 180 top
Y1  34.32,31.31 0 top

### Tracks (layer width: path | path; a pad name or v marks a point on that pad's centre or on a via)
3.3V  (via drill 0.39, 0.39 pad 0.64, 0.5)
  Top 0.203: 28.92,39.07 28.92,40.5 | 28.92,40.5 28.97,40.54 30.4,40.54 | 26.93,40.56 28.85,40.56 28.92,40.5
  Top 0.229: 38.49,22.11 37.76,21.38
  Top 0.254: 28.93,37.71 28.86,37.63 U4.P$B1 | R10.2 9.03,22.06 8.26,22.82 8.26,25.91 | 18.04,30.16 17.47,30.16 16.46,31.18 14.74,31.18 12.65,33.27 | 18.04,30.16 20.99,30.16 | 32.72,38.13 32.39,38.13 32.22,37.95 | 32.22,37.95 C24.1 31.94,37.67 31.94,39.05 30.43,40.56 30.4,40.54 | C3.1 38.69,22.43 38.56,22.3 | v27,41.08 26.93,41.02 26.93,40.56 26.79,40.56 25.78,39.55 C23.1 25.65,39.25 24.23,37.83 U4.P$W1 23.98,37.38 U4.P$Y2 | IC4.1 32.42,15.96 IC4.16 IC4.15 IC4.14 | IC4.13 30.57,15.6 IC4.14 | 33.85,24.42 33.85,22.19 R6.2 33.12,22.12 32.9,21.91 32.9,20 31.57,18.67 IC4.7 IC4.8 IC4.14 | R2.2 32.94,15.98 IC4.1 | LED2.2 34.17,10.11 34.17,11.68 32.92,12.94 IC4.1 | SW1.B 19.83,24.42 C6.1 | v17.73,30.48 18.04,30.16 | SW2.B 38.52,24.52 | THM1.2 32.72,37.45 | 32.72,37.45 32.72,37.55 33.63,36.65 v33.65,36.65 | 32.72,37.45 32.22,37.95 | U4.P$AD14 22.07,34.13 21.47,34.72 19.22,34.72 v18.89,34.39 19.16,34.12 | IC3.8 19.16,34.12 | C16.1 18.93,33.89 19.16,34.12 | U4.P$AD23 21.26,30.16 20.99,30.16 | 20.99,30.16 20.9,30.25 C20.1 | 38.49,22.11 38.49,22.23 | IC1.1 37.76,21.38 | U4.P$A22 v30.04,32.13 v30.05,32.13 31.11,32.13 C21.1 | 12.33,33.27 12.84,33.27
  Top 0.305: 28.93,37.71 28.93,39.06 28.92,39.07
  Top 0.406: SW2.B' 33.85,24.42 SW2.B 38.56,24.27 38.56,22.3 38.49,22.23 | 38.52,24.52 43.08,24.52 43.43,24.17 LED3.2 | 5.42,25.4 6.49,24.33 6.49,22.75 7.65,21.59 7.65,19.62 8.92,18.35 LED9.2 9.66,16.84 9.66,14.8 9.64,14.72 10.3,13.58 11.25,12.64 13.86,12.64 15.33,11.17 LED10.2 16.32,10.4 17.63,11.71 v19.82,11.71 U3.5 | 5.42,25.4 3.3VTAP.P$1 | LED8.2 6.15,25.91 | 6.15,25.91 5.64,25.4 5.42,25.4 | 10.3,25.91 10.91,25.91 SW1.B' SW1.B | 10.3,25.91 8.26,25.91 6.15,25.91 | U2.C 14.41,34.34 13.34,33.27 12.84,33.27 12.65,33.27 | LED7.2 10.41,35.61 10.41,34.17 11.31,33.27 12.33,33.27 12.61,33.27 12.61,31.13 C2.1 10.3,28.73 10.3,25.91 | 3V3TAP2.P$1 34.92,43.48 34.92,41.09 LED5.2 34.74,40.14 32.72,38.13 | C8.1 30.15,8.91 | 30.15,8.91 LED2.2 | LED1.2 40.72,15.32 43.31,17.91 43.31,18.68 42.18,19.8 42.18,21.97 43.43,23.22 LED3.2 | LED4.2 42.03,30.29 v43.12,29.2 44.4,27.92 44.4,24.36 LED3.2 | R3.2 17.64,42.11 LED6.2 v15.95,42.02 14.22,42.02 12.96,40.77 12.96,39.62 13.22,39.37 13.22,38.41 LED7.2 | LED7.2 10.92,36.12 | v30.55,7.49 30.55,8.51 30.15,8.91
  Bottom 0.254: v33.65,36.65 33.65,33.58 32.2,32.13 v30.05,32.13 | v15.95,42.02 16.81,41.16 26.92,41.16 v27,41.08 | v18.89,34.39 17.66,33.16 17.66,30.54 v17.73,30.48
  Bottom 0.406: 3V3TAP2.P$1 36.08,44.64 36.08,43.61 42.49,37.2 42.49,29.83 v43.12,29.2 | v19.82,11.71 26.97,11.71 30.55,8.13 v30.55,7.49
!RESET  (via drill 0.3 pad 0.25, 0.4)
  Top 0.203: 27.45,26.87 RESET.A' | 25.47,26.89 25.49,26.87 | U4.P$AC13 23.64,34.38 23.81,34.54 v24.04,34.54
  Top 0.254: v25.36,26.87 25.49,26.87 27.45,26.87 | RESET.A 25.47,26.89
  Bottom 0.203: TP3.P$1 16.93,29.24 16.93,29.59 | v24.04,34.54 19.82,34.54 19.34,35.03 17.92,35.03 17.83,34.94
  Bottom 0.254: 17.83,34.94 16.93,34.04 16.93,29.59 16.93,28.3 18.4,26.82 25.23,26.82 25.28,26.87 v25.36,26.87
A1
  Top 0.203: U4.P$A12 29.72,34.63 29.98,34.37 37.78,34.37 38.59,33.55 42.35,33.55 43,32.91
  Top 0.254: R11.1 45.2,20.57 | D6.P$1 47,17.7 47,18.77 45.4,20.37 45.2,20.57 | 43,32.91 43,30.46 45.2,28.26 45.2,20.57
A2
  Top 0.203: U4.P$A10 29.91,35.13 30.26,34.77 36.64,34.77 36.94,35.08 36.94,36.37 38.26,37.69 42.85,37.69 43.09,37.45
  Top 0.254: 43.09,37.45 45.1,35.44 | 45.1,35.44 IO9.P$1 | R9.1 43.8,34.14 45.1,35.44
A3  (via drill 0.3 pad 0.25, 0.39 pad 0.25)
  Top 0.203: U4.P$B13 28.67,34.32 27.92,34.32 27.9,34.29 v27.9,34.24 | 37.46,37.59 33.99,37.59 v33.63,37.94
  Top 0.254: 37.46,37.59 38.91,39.04 R8.1 42.4,39.53 IO10.P$1
  Bottom 0.203: v27.9,34.24 27.85,34.24 27.55,33.94 27.55,33.38 27.9,33.03 28.55,33.03 30.82,35.3 30.82,36.61 32,37.79 33.63,37.79 v33.63,37.94
A4/SCL  (via drill 0.39 pad 0.25)
  Top 0.203: v27,39.82 26.96,39.82 26.96,38.35 26.73,38.13 U4.P$J1
  Top 0.254: SCL.P$1 8.01,39.88 10.88,39.88 R13.1
  Bottom 0.254: v27,39.82 26.77,40.04 9.85,40.04 9.63,40.27 SCL.P$1
A5/SDA  (via drill 0.3 pad 0.25)
  Top 0.203: U4.P$K2 v26.48,36.58
  Top 0.254: 5,31.71 4.61,33.07 4.36,33.32 SDA.P$1 3.98,33.32 4.95,32.35 6.4,32.35 R14.1
  Bottom 0.203: v26.48,36.58 24.77,38.28 18.91,38.28 18.04,39.14 12.14,39.14 9.59,36.6
  Bottom 0.254: 9.59,36.6 6.32,33.32 SDA.P$1
D0/A6/RX  (via drill 0.3)
  Top 0.203: U4.P$B9 28.65,35.46 28.2,35.46 28.1,35.55 v27.95,35.55
  Top 0.254: RX.P$1 4,17.23 4.11,17.35 6.52,17.35 R15.1
  Bottom 0.203: 7.31,30.8 15.25,38.74 17.76,38.74 18.63,37.87 24.44,37.87 26.35,35.97 27.95,35.97 v27.95,35.55
  Bottom 0.254: RX.P$1 3.26,16.83 4.64,16.83 7.31,19.5 7.31,30.8
D1/TX  (via drill 0.3 pad 0.25)
  Top 0.203: v23.86,35.94 23.73,35.94 23.23,35.44 U4.P$AC9
  Top 0.254: TX.P$1 8.49,10.83 R16.1
  Bottom 0.203: 8.52,27.69 17.22,36.39 21.49,36.39 22.13,35.74 23.66,35.74 v23.86,35.94
  Bottom 0.254: TX.P$1 8.52,10.86 8.52,27.69
D4_LEFTBUTTON
  Top 0.178: U4.P$W24 24.23,31.02 23.87,30.66 22.96,30.66
  Top 0.203: 18.3,28.42 SW1.A 19.14,28.95 21.25,28.95 22.96,30.66
  Top 0.254: SW1.A' 18.3,28.42
D5_RIGHTBUTTON
  Top 0.203: SW2.A 38.54,28.54 38.54,32.92 37.53,33.93 29.78,33.93 29.59,34.13 U4.P$A14
  Top 0.254: SW2.A' 32.22,26.89 32.76,26.35 37.3,26.35 38.42,27.46 SW2.A
D7_SLIDESWITCH  (via drill 0.5)
  Top 0.178: 23.36,29.82 24.06,29.82 25.23,30.99 U4.P$R24
  Top 0.203: v16.84,26.67 17.22,27.05 20.59,27.05 23.36,29.82
  Top 0.254: SWITCH.P1 25.22,18.99 v25.22,16.7 25.22,13.77 SWITCH.P2
  Bottom 0.254: v16.84,26.67 15.82,25.65 15.82,18.29 18.74,15.37 24.9,15.37 25.41,15.88 25.41,16.51 v25.22,16.7
D8_NEOPIX
  Top 0.203: LED6.1 19.93,40.5 21.19,39.25 21.19,36.81 22.37,35.63 U4.P$AD8
D11_SPEAKERSD  (via drill 0.5)
  Top 0.178: U4.P$U24 24.73,31 23.99,30.25 23.15,30.25
  Top 0.203: v12.16,26.82 12.77,27.43 13.62,27.43 13.87,27.67 17.19,27.67 17.36,27.51 20.41,27.51 23.15,30.25 | v11.76,18.02 11.76,18.47 10.68,19.54 IC2.4
  Top 0.254: R10.1 9.79,19.97 IC2.4
  Bottom 0.203: v12.16,26.82 12.16,22.72 12.54,22.34 12.54,18.81 v11.76,18.02
D12/SPEAKER  (via drill 0.39, 0.4)
  Top 0.203: v27.76,38.5 27.76,37.95 27.43,37.63 U4.P$G1
  Top 0.254: C9.1 18.26,12.83 18.07,12.64 v17.98,12.64 | R12.1 41.86,11.66 43.05,10.47 IO12.P$1
  Bottom 0.254: v27.76,38.5 27.86,38.5 29.98,40.62 32.88,40.62 35.77,37.73 35.77,32.44 43.09,25.11 43.09,20.86 36.01,13.78 36.01,13.15 | v17.98,12.64 18.49,13.15 36.01,13.15 | IO12.P$1 40.78,12.89 36.27,12.89 36.01,13.15
D13_LED  (via drill 0.3 pad 0.25, 0.39 pad 0.25)
  Top 0.203: 34.11,41.15 32.64,39.68 v32.64,39.17 | v28.1,33.59 28.37,33.85 28.71,33.85 U4.P$B15
  Top 0.254: R5.1 33.31,43.09 34.11,42.29 34.11,41.15
  Bottom 0.203: v32.64,39.17 30.38,36.91 30.38,35.56 28.41,33.59 v28.1,33.59
D24_LISIRQ  (via drill 0.39)
  Top 0.203: v36.9,27.43 37.09,27.62 37.09,29.13 38.1,30.14 38.1,32.77 37.34,33.53 29.54,33.53 29.43,33.63 U4.P$A16
  Top 0.254: v28.97,16.45 28.97,16.51 29.41,16.96 IC4.11
  Bottom 0.254: v36.9,27.43 39,25.34 39,22.61 35.95,19.56 35.95,15.81 34.81,14.67 30.74,14.67 v28.97,16.45
D+
  Top 0.203: U4.P$AD6 22.45,36.13 21.62,36.97 21.62,43.4 22.66,44.45 25.21,44.45 25.36,44.6 25.36,45.4 CN1.D+
D-
  Top 0.203: U4.P$AD4 22.56,36.63 22.03,37.16 22.03,43.16 22.88,44.01 25.65,44.01 26.01,44.36 26.01,45.4 CN1.D-
DEC1
  Top 0.203: U4.P$C1 28.23,37.76 28.45,37.97 28.45,39.74 C7.1
DEC3
  Top 0.203: C14.1 28.68,29.87 28.29,30.26 28.29,31.32 U4.P$D23
DEC4_6  (via drill 0.35)
  Top 0.178: 33.65,29.32 28.6,29.32
  Top 0.203: C25.1 29.59,39.64 29.59,37.01 29.64,37.01 | 29.64,37.01 29.01,36.38 U4.P$B5 | U4.P$E24 27.73,30.19 28.6,29.32 | v34.3,29.03 33.94,29.03 33.65,29.32 | 29.64,37.01 30.95,37.01 31.38,36.58 v31.63,36.58
  Bottom 0.203: v31.63,36.58 32.37,37.31 33.92,37.31 34.28,36.95 34.28,29.05 v34.3,29.03
DEC5
  Top 0.203: C15.1 25.73,30.12 U4.P$N24
DECUSB
  Top 0.178: C22.1 23.49,38.77 22.97,38.25 22.97,37.52 23.25,37.24 23.25,36.4 U4.P$AC5
GND  (via drill 0.39)
  Top 0.254: U4.P$B7 28.38,35.88 28.15,36.11 27.35,36.11 25.98,34.74 U4.THERMPAD | U4.P$F23 27.48,32.88 | C6.2 19.03,25.62 18.93,25.72 14.23,25.72 v13.34,26.61 | IC4.10 29.42,17.45 29.35,17.53 28.84,17.53 28.08,16.76 27.91,16.93 | IC4.12 29.85,16.46 29.54,16.14 29.54,15.37 29.16,14.99 28.08,14.99 27.91,14.82 SWITCH.S2 | IC1.6 36.21,21.58 IC1.2 35.51,21.38 IC1.7 | IC1.5 39.6,20.96 C3.2 | IC1.8 37.49,19.05 37.79,19.05 37.92,18.92 37.92,17.65 38.11,17.46 39.57,17.46 40.21,18.1 40.21,18.79 LED1.4 | IC4.5 32.57,17.95 31.95,17.34 v31.95,17.02 | C16.2 19.58,33.11 v19.71,33.11 | C21.2 32.72,32.61 36.89,32.61 37.17,32.33 37.17,30.51 37.06,30.4 C12.2
  Top 0.305: SWITCH.S1 27.91,16.93
  Top 0.406: 27.48,32.88 U4.THERMPAD | PWR.C 21.26,48.68 CN1.SPRT@4 21.91,48.23 CN1.BASE@2 CN1.BASE@1 | CN1.SPRT@3 31.21,48.13 L.C | C14.2 29.07,28.47 29.92,27.62 v30.36,27.62
  Top 0.508: GNDTAP2.P$1 16.51,7.94 17.66,7.94 v18.42,7.18
  Bottom 0.508: GNDTAP.P$1 44.84,25.4 v41.86,28.39
  other vias: 34.99,36.67 30.96,41.47 30.81,39.05 26.72,34.98 24.97,33.39 24.93,35.4 26.93,33.33 15.88,40.83 9.22,34.29 11.82,32.32 11.44,17.02 11.63,21.34 18.7,30.99 21.79,6.54 27.76,7.62 28.9,7.62 27.89,15.43 34.81,9.33 24.58,28.45 26.3,27.75 30.55,24.51 30.62,21.72 31.89,25.97 32.01,22.73 36.65,23.37 36.86,25.39 41.67,25.65 40.84,21.46 37.97,35.7 35.93,29.57 26.88,29.48 39.7,30.46 20.14,39 20.69,41.94 23.57,42.74 25.35,42.74 13.38,34.47 9.47,13.4 13.66,11.18 30.62,20.07 31.95,20.51 21.8,31.65 33.11,27.17 34.93,25.51 29.96,29.97 25.98,32.35 24.63,32.35 27.3,32.3 15.9,36.51 36.84,39.43 6.12,28.89 9.29,25.08 7.44,18.1 6.3,21.27
  pour Bottom: 14.74,50.8 14.6,43.08 35.42,43.08 35.57,50.8
  pour Top (isolate 0.254): 25.41,5.08 arc-90 5.09,25.4 arc-90 25.41,45.72 arc-90 45.73,25.4 arc-90
  pour Bottom (isolate 0.254, rank 2): 25.41,5.08 arc-90 5.09,25.4 arc-90 25.41,45.72 arc-90 45.73,25.4 arc-90
LIGHT  (via drill 0.3, 0.4)
  Top 0.203: U2.E 16.76,34.3 | U4.P$B11 28.16,34.88 v28.15,34.89
  Top 0.254: 16.76,34.3 R4.2 | U2.E 16.72,37.19 v17.4,37.86
  Bottom 0.203: v28.15,34.89 27.62,34.89 26.94,35.56 26.2,35.56 24.27,37.49 18.43,37.49 18.06,37.86 v17.4,37.86
LIS_SCL  (via drill 0.3 pad 0.25, 0.39)
  Top 0.203: v28.1,32.48 28.15,32.54 28.15,32.91 28.62,33.38 U4.P$B17
  Top 0.254: IC4.4 34.01,17.45 R2.1 34.24,18.73 v34.49,18.99
  Bottom 0.203: 35.82,20.32 35.82,27.5 34.85,28.47 34.02,28.47 33.25,29.24 33.25,29.75 33.26,29.76 33.26,30.89 32.76,31.38 29.57,31.38 28.47,32.48 v28.1,32.48
  Bottom 0.254: v34.49,18.99 35.82,20.32
LIS_SDA  (via drill 0.39)
  Top 0.203: v34.29,27.25 34.63,27.25 36.2,28.83 36.2,28.84 37.64,30.27 37.64,32.6 37.12,33.11 30.01,33.11 29.53,32.63 U4.P$A20
  Top 0.254: IC4.6 32.13,18.3 33.02,19.19 v33.46,19.19 33.92,19.65 R6.1
  Bottom 0.254: v34.29,27.25 34.16,27.13 34.16,19.89 v33.46,19.19
N$1
  Top 0.254: PWR.A 19.06,45.08 R3.1
N$3  (via drill 0.5)
  Top 0.406: F1.1 18.32,2.39 v18.04,2.67 | D2.C v30.55,4 | v33.41,11.11 32.01,12.51 D1.C
  Bottom 0.406: v18.04,2.67 18.68,2.67 20.08,4.06 30.55,4.06 | v33.41,11.11 33.41,6.92 30.55,4.06 | v30.55,4 30.55,4.06
N$4
  Top 0.203: U4.P$H23 26.98,31.5 27.26,31.22 27.26,30.03 28.36,28.93
  Top 0.254: C10.1 29.49,26.01
  Top 0.305: 28.36,28.93 28.36,28.12
  Top 0.508: 28.36,28.12 29.47,27 C10.1 | 29.49,26.01 L1.1
N$6
  Top 0.254: C9.2 15.15,13.97 R1.1
N$7
  Top 0.406: BATT.2 24.41,5 25.03,4.38 27.38,4.38 28.78,5.79 D2.A
N$8  (via drill 0.5)
  Top 0.254: v10.17,24.45 10.17,23.08 IC2.3 | v12.07,14.03 R1.2
  Bottom 0.254: v10.17,24.45 10.17,16.26 11.82,14.61 11.82,14.29 v12.07,14.03
N$9
  Top 0.254: IC2.6 16.74,19.97 19.89,16.82 SP1.+
N$10
  Top 0.254: L.A 31.63,44.92 R5.2
N$11
  Top 0.254: LED1.1 38.64,15.94 38.64,13.55 36,10.91 LED2.3
N$12
  Top 0.254: LED3.1 41.65,23.36 41.65,18.86 LED1.3
N$13  (via drill 0.5)
  Top 0.254: LED2.1 31.45,9.78 v31.06,9.78 | v17.22,9.27 17.83,8.65 LED10.3
  Bottom 0.254: v31.06,9.78 31.76,9.08 31.76,7.37 30.93,6.54 24.27,6.54 21.54,9.27 v17.22,9.27
N$14
  Top 0.254: LED6.3 14.46,40.04 14.46,36.52 12.93,34.99 LED7.1
N$15
  Top 0.254: IC2.1 12.58,22.92 13.05,23.39 16.94,23.39 18.29,22.04 SP1.-
N$16
  Top 0.254: LED7.3 8.92,27.37 LED8.1
N$17
  Top 0.254: LED8.3 7.39,22.76 8.34,21.81 8.34,19.86 8.91,19.29 9.61,19.29 LED9.1
N$18
  Top 0.254: LED9.3 10.67,14.04 11.57,13.15 14.98,13.15 LED10.1
N$19
  Top 0.254: LED3.3 43.43,27.7 40.51,30.62 LED4.1
N$20  (via drill 0.5)
  Top 0.254: LED5.1 36.88,38.63 v37.16,38.35 | LED4.3 39.8,35.61 v39.01,36.4
  Bottom 0.254: v39.01,36.4 37.16,38.25 v37.16,38.35
N$22
  Top 0.178: 29.31,31.55 32.68,31.55 32.92,31.31 34.52,31.31
  Top 0.203: U4.P$A23 29.31,31.55 | 34.52,31.31 Y1.3 36.02,31.93 C12.1
N$23
  Top 0.178: 30.75,31.18 28.78,31.18 | C13.1 30.75,31.18 | 30.75,31.18 32.43,31.18
  Top 0.203: U4.P$B24 28.78,31.18 | Y1.1 32.93,30.68 32.43,31.18
PDM_CLK  (via drill 0.39 pad 0.25, 0.5)
  Top 0.203: v36.78,18.29 36.2,18.29 35.29,19.2 35.29,19.91 35.91,20.53 IC1.3 | v20.48,35.36 20.63,35.2 21.62,35.2 22.2,34.63 U4.P$AD12
  Bottom 0.203: 15.31,29.59 15.31,33.14 17.66,35.48 20.35,35.48 v20.48,35.36
  Bottom 0.254: 15.31,29.59 15.31,17.84 18.98,14.17 35,14.17 36.9,16.08 36.9,18.16 v36.78,18.29
PDM_DAT  (via drill 0.3 pad 0.25, 0.5)
  Top 0.203: v39.06,18.54 39.06,19.25 37.78,20.53 IC1.4 | U4.P$AC11 23.59,34.88 23.73,35.03 23.75,35.03 v23.95,35.23
  Bottom 0.203: v23.95,35.23 21.8,35.23 21.05,35.98 17.49,35.98 14.42,32.91 14.42,29.21
  Bottom 0.254: 14.42,29.21 14.42,17.97 18.74,13.65 35.19,13.65 38.93,17.4 38.93,18.42 v39.06,18.54
QSPI_CS
  Top 0.203: IC3.1 18.33,31.72 17.59,32.46 17.59,35.36 18.4,36.17 21.24,36.17 22.28,35.13 U4.P$AD10
QSPI_DATA0  (via drill 0.3 pad 0.25, 0.39 pad 0.25)
  Top 0.203: U4.P$AC17 23.26,33.35 23.88,33.35 v24.01,33.22 | v21.76,33.38 21.76,33.54 21.21,34.09 IC3.5
  Bottom 0.203: v24.01,33.22 24.01,33.27 23.94,33.35 21.81,33.35 21.77,33.38 v21.76,33.38
QSPI_DATA1  (via drill 0.3 pad 0.25, 0.39 pad 0.25)
  Top 0.203: v23.89,32.51 23.52,32.88 U4.P$AC19 | v20.12,32.43 20.21,32.34 IC3.2
  Bottom 0.203: v23.89,32.51 23.63,32.77 23.17,32.77 22.83,32.43 v20.12,32.43
QSPI_DATA2
  Top 0.203: U4.P$AD22 22.43,32.13 22.27,32.28 20.92,32.28 20.71,32.07 IC3.3
QSPI_DATA3
  Top 0.203: U4.P$AD18 22.38,33.13 21.97,32.72 20.74,32.72 20.33,33.13 20.33,33.59 20.21,33.71 IC3.7
QSPI_SCK  (via drill 0.3 pad 0.25, 0.39 pad 0.25)
  Top 0.203: v20.94,33.38 20.94,33.53 20.71,33.76 IC3.6 | v23.81,33.88 v23.8,33.88 U4.P$AC15
  Bottom 0.203: v20.94,33.38 20.94,33.43 21.5,33.99 22.87,33.99 22.97,33.88 v23.81,33.88
RF
  Top 0.203: L1.2 C11.1
  Top 0.508: X1.FP 29.16,23.23 C11.1
SWCLK  (via drill 0.3 pad 0.25)
  Top 0.203: U4.P$AA24 23.73,31.27 23.33,31.67 v23.33,31.73
  Bottom 0.203: v23.33,31.73 21.78,30.18 21.78,29.57 21.85,29.49 TP1.P$1
SWDIO  (via drill 0.39 pad 0.25)
  Top 0.203: U4.P$AC24 22.85,31.13 21.28,29.56 v20.46,29.56
  Bottom 0.203: v20.46,29.56 19.92,29.56 TP2.P$1
TEMP_SENSE
  Top 0.203: U4.P$A8 30.11,35.63 30.33,35.41 30.75,35.41 31.1,35.76 32.4,35.76 THM1.1
  Top 0.254: THM1.1 33.91,35.43 R7.2
VBUS  (via drill 0.39)
  Top 0.254: U4.P$AD2 22.48,37.38 22.48,42.88 23.16,43.56 26.25,43.56 | CN1.VBUS 26.66,45.4 26.66,44.12 | 26.25,43.71 26.66,44.12 | C19.1 27.35,43.43 26.66,44.12
  Top 0.406: 26.25,43.71 26.25,43.56 26.25,43.55 v26.55,43.24 | D1.A 35.88,14.36 v36.71,13.53
  Bottom 0.406: v26.55,43.24 27.92,43.24 28.94,42.23 35.42,42.23 40.7,36.94 40.7,28.33 43.89,25.15 43.89,16.51 40.9,13.53 v36.71,13.53
VCC  (via drill 0.5)
  Top 0.254: IC2.5 11.63,19.52 12.73,18.42 15.69,18.42 17.66,16.45 17.66,15.56 18.36,14.86 23.7,14.86 24.5,14.06 24.5,11.47
  Top 0.406: F1.2 19.89,7.08 20.9,8.1 U3.1 20.9,10.22 23.44,10.22 | 23.44,10.22 22.8,9.59 U3.3 22.8,5.4 25.54,2.67 v25.54,2.48 | 23.44,10.22 23.89,10.67 C5.1 24.5,11.47 25.35,12.32 29.16,12.32 29.79,11.69 C4.1
  Bottom 0.406: v25.54,2.48 25.92,2.1 32.65,2.1 35.83,5.28 VCC2.P$1